# EAGLE design NavModule (EAGLE 5.12)
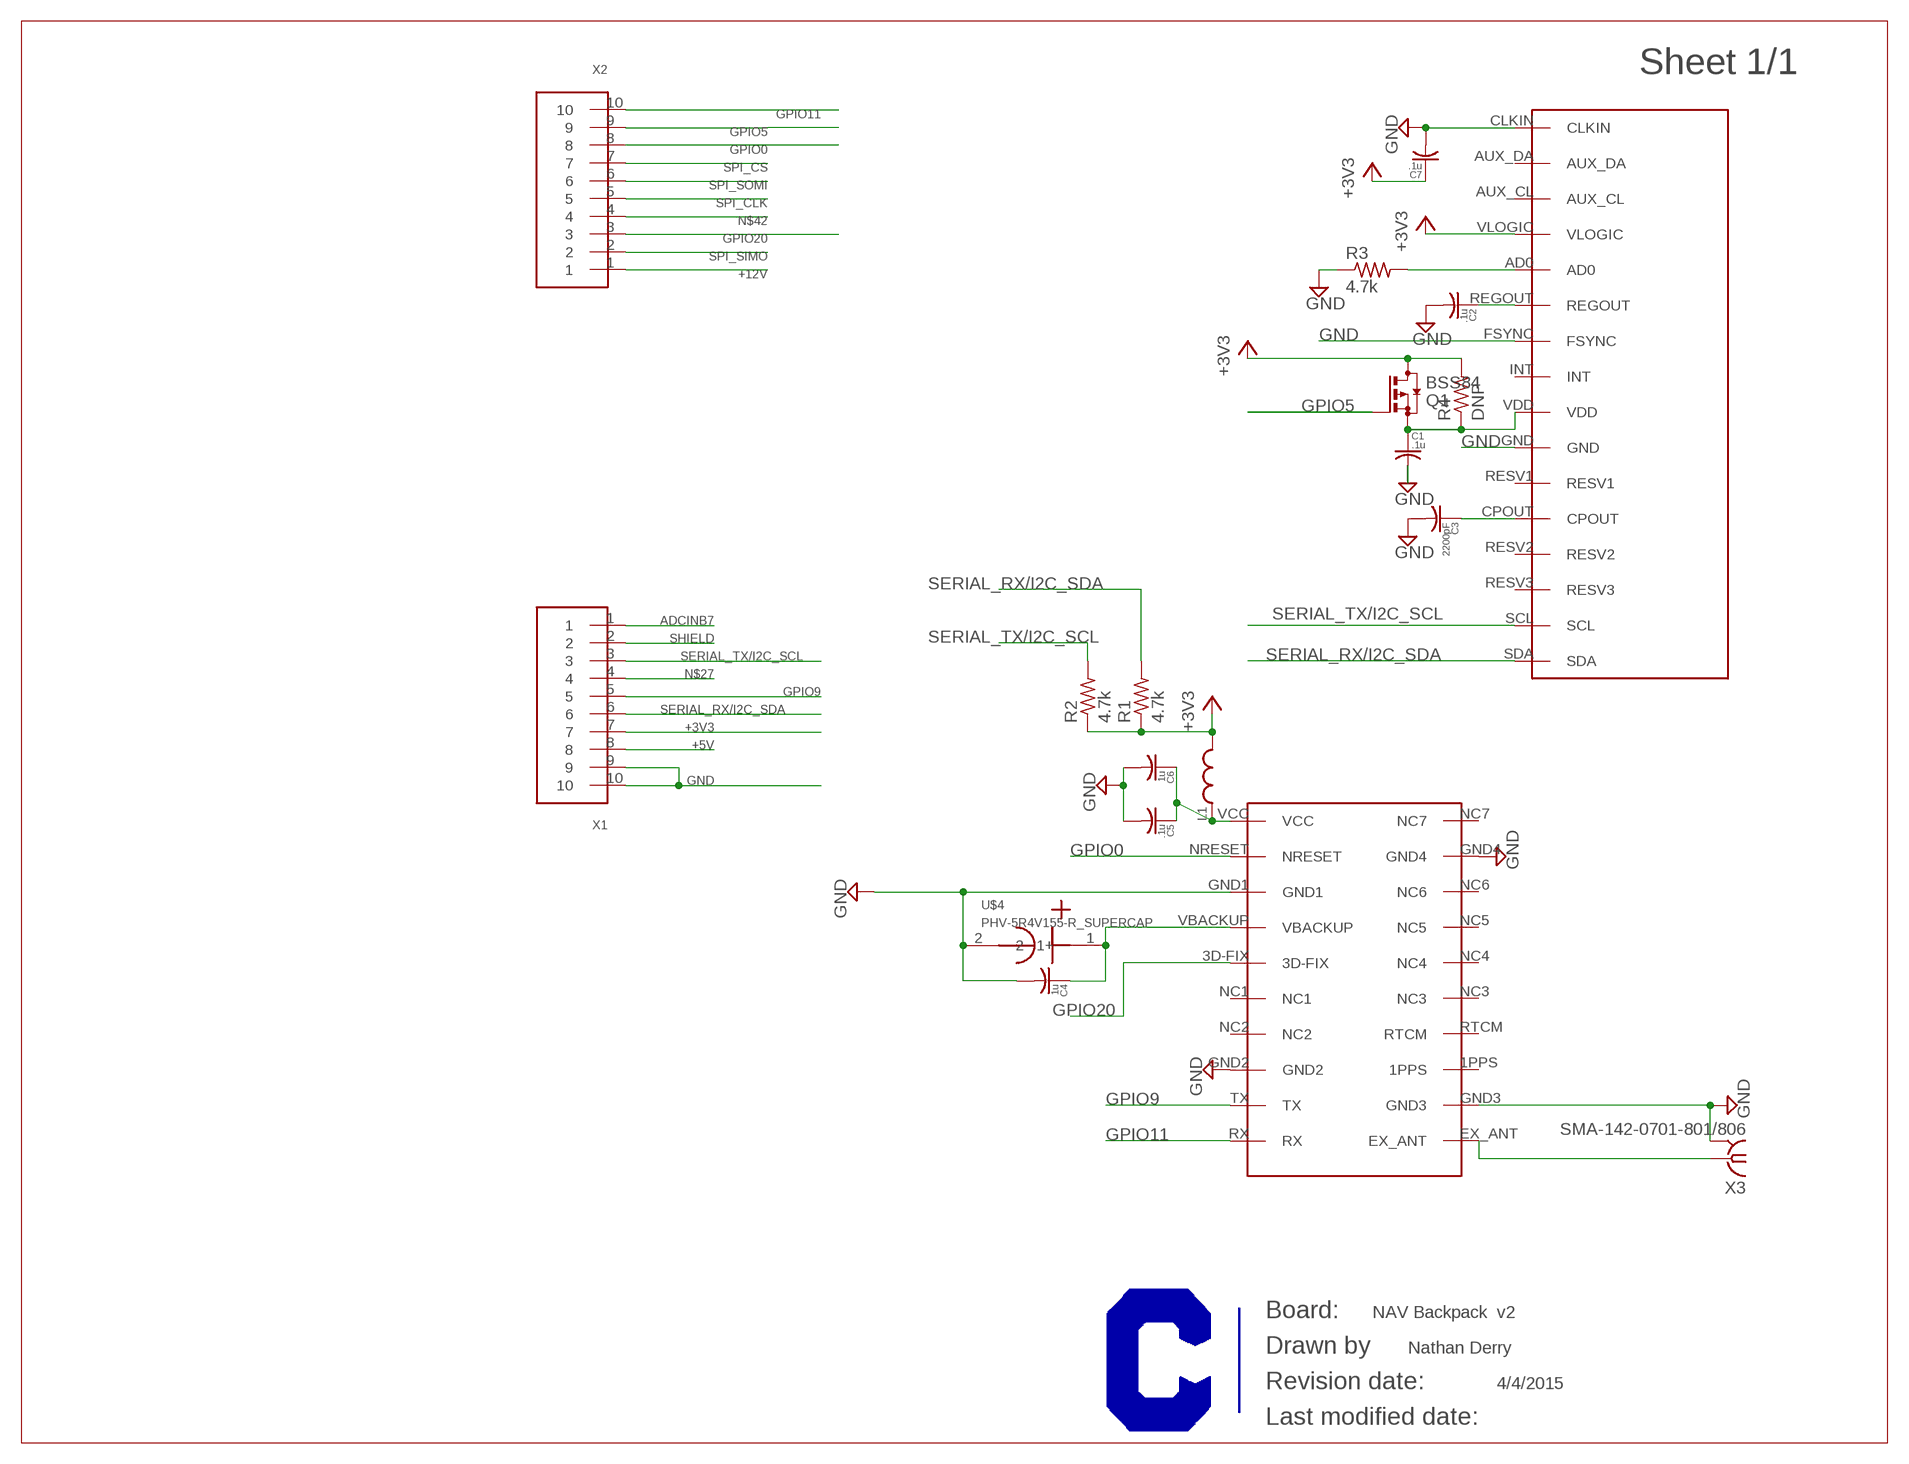
[diagram p0: schematic, sheet 1]

## Parts
C1  .1u  C-USC0603  [C0603]
C2  .1u  C-USC0603  [C0603]
C3  2200pF  C-USC0603  [C0603]
C4  1u  C-USC0603  [C0603]
C5  .1u  C-USC0603  [C0603]
C6  1u  C-USC0603  [C0603]
C7  .1u  C-USC0603  [C0603]
L1  INDUCTOR  [0603]
Q1  BSS84  [SOT23]
R1  4.7k  R-US_R0603  [R0603]
R2  4.7k  R-US_R0603  [R0603]
R3  4.7k  R-US_R0603  [R0603]
R4  DNP  R-US_R0603  [R0603]
U$1  CURRENT-C-LETTER-LANDSCAPE  [BLANK]
U$2  MPU-6050  [MPU-6050]
U$3  FGPMMOPA6H_GTPA013  [FGPMMOPA6H_GTPA013]
U$4  PHV-5R4V155-R_SUPERCAP  [PHV-5R4H155-R_SUPERCAP]
X1  MALE-1X10-0.05"-PCB-VERT  [MA0.05"-1X10]
X2  MALE-1X10-0.05"-PCB-VERT  [MA0.05"-1X10]
X3  SMA-142-0701-801/806  [J502-ND-142-0701-801/806]

## Nets
+3V3: C7.1 L1.B Q1.3(D) R1.1 R2.1 R4.2 U$2.VLOGIC X1.7
+5V: X1.8
+12V: X2.1
ADCINB7: X1.1
GND: C1.2 C2.2 C3.2 C4.2 C5.2 C6.2 C7.2 R3.1 U$2.CLKIN U$2.FSYNC U$2.GND U$3.GND1 U$3.GND2 U$3.GND3 U$3.GND4 U$4.2 X1.9 X1.10 X3.G@1(GND)
GPIO0: U$3.NRESET X2.8
GPIO5: Q1.1(G) X2.9
GPIO9: U$3.TX X1.5
GPIO11: U$3.RX X2.10
GPIO20: U$3.3D-FIX X2.3
N$1: C4.1 U$3.VBACKUP U$4.1(1+)
N$2: C3.1 U$2.CPOUT
N$3: R3.2 U$2.AD0
N$4: C5.1 C6.1 L1.A U$3.VCC
N$5: C2.1 U$2.REGOUT
N$6: U$3.EX_ANT X3.1
N$7: C1.1 Q1.2(S) R4.1 U$2.VDD
N$27: X1.4
N$42: X2.4
SERIAL_RX/I2C_SDA: R1.2 U$2.SDA X1.6
SERIAL_TX/I2C_SCL: R2.2 U$2.SCL X1.3
SHIELD: X1.2
SPI_CLK: X2.5
SPI_CS: X2.7
SPI_SIMO: X2.2
SPI_SOMI: X2.6
Unconnected: U$2.AUX_CL U$2.AUX_DA U$2.INT U$2.RESV1 U$2.RESV2 U$2.RESV3 U$3.1PPS U$3.NC1 U$3.NC2 U$3.NC3 U$3.NC4 U$3.NC5 U$3.NC6 U$3.NC7 U$3.RTCM

## Notes on the sheet
- NAV Backpack | v2
- Nathan Derry
- 4/4/2015

## Power pins joined to a net without a drawn wire
GND: X3.G@2(GND) X3.G@3(GND) X3.G@4(GND)

## Library data of the parts
C1-C7 = rcl:C-US: CAPACITOR, American symbol
L1 = Passives:INDUCTOR
Q1 = transistor-small-signal:BSS84: P-CHANNEL MOS FET
R1-R4 = rcl:R-US_: RESISTOR, American symbol
U$1 = Frames:CURRENT-C-LETTER-LANDSCAPE; BOM: EXCLUDE
U$2 = Invensense:MPU-6050
U$3 = GlobalTop:FGPMMOPA6H_GTPA013: Datasheet:http://www.adafruit.com/datasheets/GlobalTop-FGPMMOPA6H-Datasheet-V0A.pdf; PARTNO: FGMMOPA6H_GTPA013
U$4 = Passives:PHV-5R4V155-R_SUPERCAP: Datasheet: http://datasheet.octopart.com/PHV-5R4V155-R-Cooper-Bussmann-datasheet-11640353.pdf 4/4/2015 Made by Nate Derry 1.5F supercapacitor to be used on Nav Backpack as backup power; PARTNO: PHV-5R4V155-R
X1 X2 = Pin headers:MALE-1X10: Male pin header, 1 row, 10 pins; PARTNO: BD020-10-A-J-0350-0300-L-G
X3 = con-coax:SMA-: SMA 50 Ohm End Launch Jack Receptacle - Round Contact Johnson Components Source: www.johnsoncomponents.com .. J502-ND.pdf; MF: JOHNSON COMPONENTS; MPN: 142-0701-801; OC_FARNELL: 1608592; OC_NEWARK: 90F2624

## Board
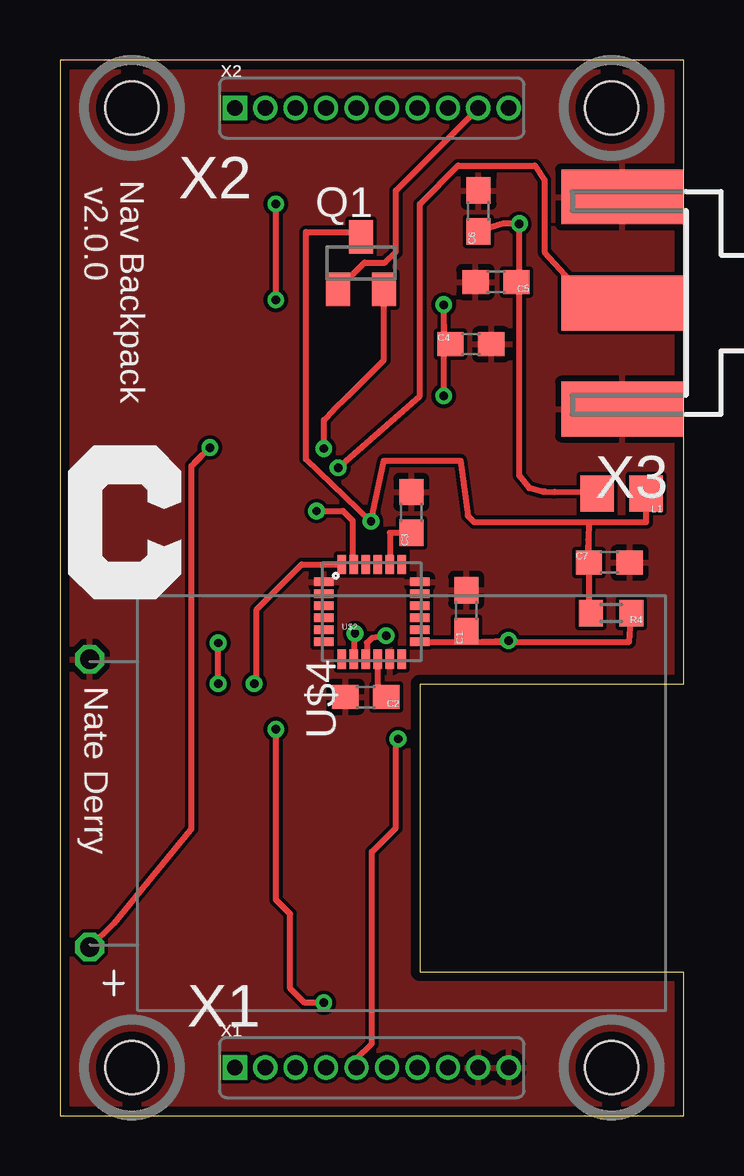
[diagram p1: board, top side]
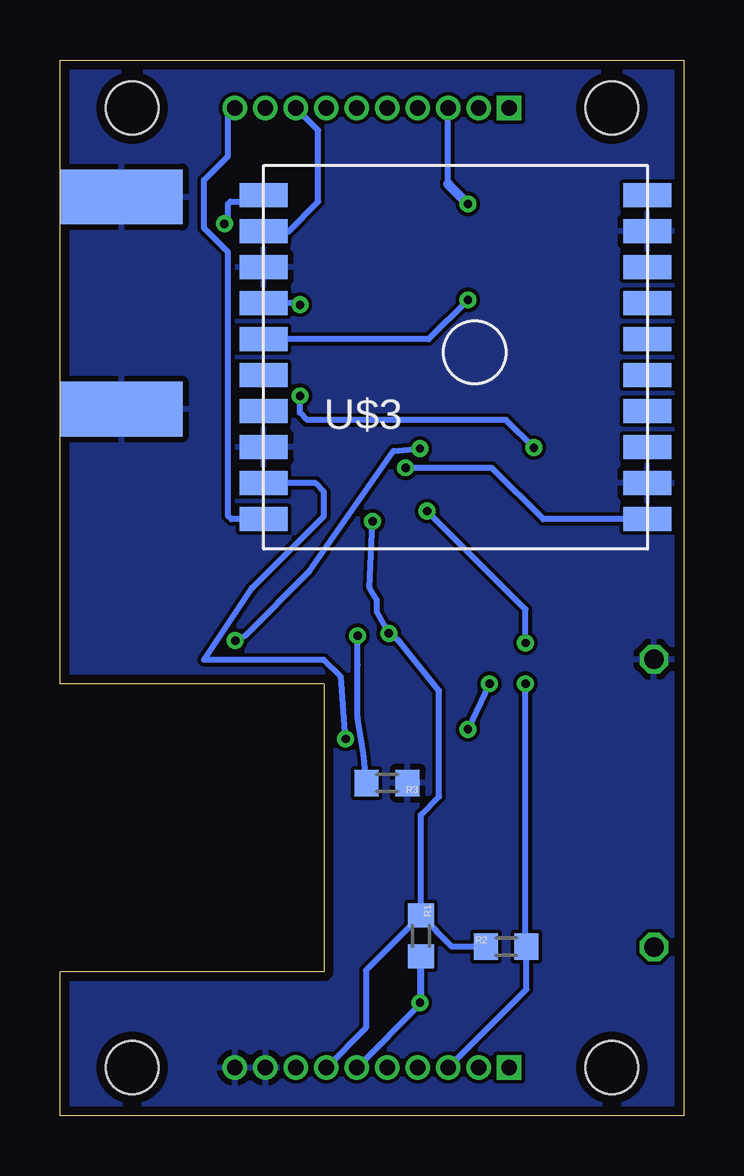
[diagram p2: board, bottom side, seen from below]

Size 26.01 x 44 mm. Coordinates in mm from the lower left corner, seen from the top.
Outline: 0,0 26,0 26,6 15,6 15,18 26,18 26,44 0,44 0,0
Copper layers (1*16): Top 0.0356mm / dielectric 1.5011mm / Bottom 0.0356mm
Design rules "OSH Park 2-layer": minimum track width 6mil, minimum drill 13mil, track to track 6mil, track to pad 6mil, pad to pad 6mil, via to via 6mil, smd to smd 6mil, copper to edge 15mil, drill to drill 6mil, minimum pad ring 7mil, minimum via ring 7mil, stop-mask expansion 4mil, vias tented up to drill 25mil, thermal gap 10mil
Holes 2.2 mm at 3,42 23,42 23,2 3,2

### Footprints (pad centres in the part's own frame; a part is rotated, then mirrored left to right if it is on the bottom)
C0603 = smd 1.1 x 1: 1 -0.85,0; 2 0.85,0
0603 = smd 1.4 x 1.5: A 1.025,0; B -1.025,0
SOT23 = smd 1 x 1.4: 1 -0.95,-1.1; 2 0.95,-1.1; 3 0,1.1
R0603 = smd 1 x 1.1: 1 -0.85,0; 2 0.85,0
MPU-6050 = smd 0.34 x 0.8: AD0 -0.25,-1.975; AUX_CL -1.25,-1.975; CPOUT 0.75,1.975; FSYNC 0.75,-1.975; INT 1.25,-1.975; REGOUT 0.25,-1.975; RESV1 1.25,1.975; RESV2 0.25,1.975; RESV3 -0.25,1.975; SCL -0.75,1.975; SDA -1.25,1.975; VLOGIC -0.75,-1.975 | smd 0.8 x 0.34: AUX_DA -2,-1.25; CLKIN -2,1.25; GND 2,1.25; NC1 -2,0.75; NC2 -2,0.25; NC3 -2,-0.25; NC4 -2,-0.75; NC5 2,-0.75; NC6 2,-0.25; NC7 2,0.25; NC8 2,0.75; VDD 2,-1.25
FGPMMOPA6H_GTPA013 = smd 2 x 1: 1PPS 8,-3.75; 3D-FIX -8,0.75; EX_ANT 8,-6.75; GND1 -8,3.75; GND2 -8,-3.75; GND3 8,-5.25; GND4 8,5.25; NC1 -8,-0.75; NC2 -8,-2.25; NC3 8,-0.75; NC4 8,0.75; NC5 8,2.25; NC6 8,3.75; NC7 8,6.75; NRESET -8,5.25; RTCM 8,-2.25; RX -8,-6.75; TX -8,-5.25; VBACKUP -8,2.25; VCC -8,6.75
PHV-5R4H155-R_SUPERCAP = drill 0.8 octagon: 1 6,-13; 2 -6,-13
MA0.05"-1X10 = drill 0.65 pad 1.016 square: 1 -5.715,0 | drill 0.65 pad 1.016 round: 2 -4.445,0; 3 -3.175,0; 4 -1.905,0; 5 -0.635,0; 6 0.635,0; 7 1.905,0; 8 3.175,0; 9 4.445,0; 10 5.715,0
J502-ND-142-0701-801/806 = smd 5.08 x 2.286: 1 2.565,0; G@1 2.565,4.42; G@2 2.565,-4.42 | smd 5.08 x 2.286 bottom: G@3 2.565,4.42; G@4 2.565,-4.42

### Placement (x,y rotation side)
C1  16.94,21.05 90 top
C2  12.75,17.45 180 top
C3  14.65,25.14 90 top
C4  17.13,32.15 0 top
C5  18.18,34.75 180 top
C6  17.45,37.71 90 top
C7  22.9,23.05 0 top
E$1  [CURRENT-0.25"]  0.4,21.6 0 top
L1  23.42,25.93 180 top
Q1  12.55,35.53 0 top
R1  10.96,7.49 270 bottom
R2  7.41,7.04 0 bottom
R3  12.37,13.86 180 bottom
R4  22.98,20.94 180 top
U$1  0,0 0 top
U$2  13,21 0 top
U$3  9.52,31.61 0 bottom
U$4  14.24,13.02 270 top
X1  13,2 0 top
X2  13,42 0 top
X3  26.01,33.87 180 top

### Tracks (layer width: path | path; a pad name or v marks a point on that pad's centre or on a via)
+3V3  (via drill 0.35)
  Top 0.254: 22.06,24.73 22.02,24 | 22.02,24 21.96,22.86 | 22.06,24.73 24.45,24.73 L1.B | v12.3,20.1 12.25,20.05 U$2.VLOGIC | 22.06,24.73 17.27,24.73 17,25 16.7,27.3 13.5,27.3 v12.97,24.77 10.26,27.36 10.26,36.83 12.7,36.83 12.7,36.78 Q1.3 | R4.2 22.05,20.94 C7.1 22.02,23.05 22.02,24
  Bottom 0.254: R2.1 9.66,7.04 R1.1 | X1.7 13.25,3.65 13.25,6.05 R1.1 | R1.1 11,8.34 | v12.97,24.77 13.1,22 12.8,21.5 12.8,21 v12.3,20.1 11.9,19.8 10.2,17.7 10.2,13.3 10.96,12.54 R1.1
GND
  pour Top: 0,44 26,44 26,18 15,18 15,6 26,6 26,0 0,0
  pour Bottom: 0,44 26,44 26,18 15,18 15,6 26,6 26,0 0,0
GPIO0
  Bottom 0.254: U$3.NRESET 17.78,36.83 16.51,36.83 15.24,38.1 15.24,41.06 X2.8
GPIO5
  Top 0.254: Q1.1 11.43,34.29 12.7,35.56 13.56,35.56 14,36 14,38.55 X2.9
GPIO9  (via drill 0.35)
  Top 0.254: X1.5 12.37,2.37 13,3 13,11 14,12 14,15.3 v14.1,15.7
  Bottom 0.254: U$3.TX 15.36,26.36 15,26 15,25 18,22 20,19 15,19 14.3,18.3 v14.1,15.7
GPIO11
  Bottom 0.254: U$3.RX 18.86,24.86 19,25 19,36 20,37 20,39 19,40 19,41.72 X2.10
GPIO20  (via drill 0.35)
  Top 0.254: v9,34 v9,38
  Bottom 0.254: 9.82,38.83 X2.3 | U$3.3D-FIX 10.64,32.36 v9,34
  Bottom 0.406: v9,38 9.82,38.83
N$1  (via drill 0.35)
  Top 0.254: U$4.1 2.27,8.02 3.64,9.69 5.44,11.9 5.48,11.94 5.48,27.07 5.71,27.3 | 6.3,27.9 v6.24,27.84 5.48,27.08 5.49,27.08 5.71,27.3 | 5.71,27.3 v6.25,27.84 | v16,30 16,33 | 16,33 v16,33.8 | C4.1 16,32.15 16,33
  Bottom 0.254: v16,30 16,29.3 15.7,29 7.41,29 v6.25,27.84 v6.24,27.84 6.2,27.8 | v16,33.8 16.06,33.86 U$3.VBACKUP
N$2
  Top 0.254: C3.1 13.75,24.29 U$2.CPOUT
N$3  (via drill 0.35)
  Top 0.254: U$2.AD0 12.8,19.07 12.8,19.7 13,19.9 v13.6,20
  Bottom 0.254: v13.6,20 13.6,18.8 13.6,16.6 13.36,15.1 R3.2
N$4  (via drill 0.35)
  Top 0.254: 19.15,35 19.15,26.67 19.57,26.15 20.1,26.02 | 19.15,35 v19.15,37.17 19.01,37.17 19,37.18 | 20.1,26.02 22.3,26 L1.A | 19,37.18 18.47,37.18 C6.1 | 19,37.18 v19.16,37.18 | 20.1,26.02 20.2,26.02 20.62,26 | C5.1 19.15,34.75 19.15,35
  Bottom 0.254: U$3.VCC 17.78,38.1 18.9,38.1 19,38 19,37.32 v19.15,37.17
N$5
  Top 0.254: C2.1 13.25,17.45 U$2.REGOUT
N$6  (via drill 0.35)
  Top 0.254: X3.1 22.77,33.17 20.2,36 20.2,39 19.8,39.6 16.6,39.6 15,38 15,30 v11.6,27
  Bottom 0.254: U$3.EX_ANT 5.86,24.86 8,27 v11.6,27
N$7  (via drill 0.35)
  Top 0.254: U$2.VDD 17,19.75 | 17,19.75 23.73,19.75 R4.1 | Q1.2 13.5,31.5 12,30 11.4,29.4 11,29 11,28.3 v11,27.8 | 17,19.75 v18.7,19.8 | 17,19.75 16.94,19.75 C1.1
  Bottom 0.254: v18.7,19.8 18.3,20 15.6,22.7 12.1,27.7 v11,27.8
SERIAL_RX/I2C_SDA  (via drill 0.35)
  Top 0.254: 11.75,23.15 U$2.SDA 10.07,22.98 8.2,21.1 8.2,18.1 v8.1,18 | v11,4.7 10.2,4.7 9.6,5.3 9.6,8.4 9,9 v9,16.1
  Bottom 0.254: R1.2 10.96,4.67 X1.6 | R1.2 10.96,5.04 | R1.2 11,6.6 v11,4.7 | v9,16.1 v8.1,18
SERIAL_TX/I2C_SCL  (via drill 0.35)
  Top 0.254: v6.6,18 v6.6,19.7 | v10.7,25.2 11.8,25.2 12.2,24.8 12.2,23.02 U$2.SCL
  Bottom 0.254: X1.3 6.56,5.26 R2.2 6.6,7.04 v6.6,18 | v6.6,19.7 6.6,21.1 v10.7,25.2

### Text on the board
tPlace: X2 | v2.0.0 | Nav Backpack | Nate Derry | X1